# Altium schematic sheet ETH-PHY.SchDoc
size A4; CompanyName: Technische Hochschule Nürnberg Georg Simon Ohm; Organization: UltraZohm; Address1: Kesslerplatz 12; Address2: 90489 Nürnberg; Address3: GERMANY; SheetNumber: 30; Website: www.ultrazohm.com
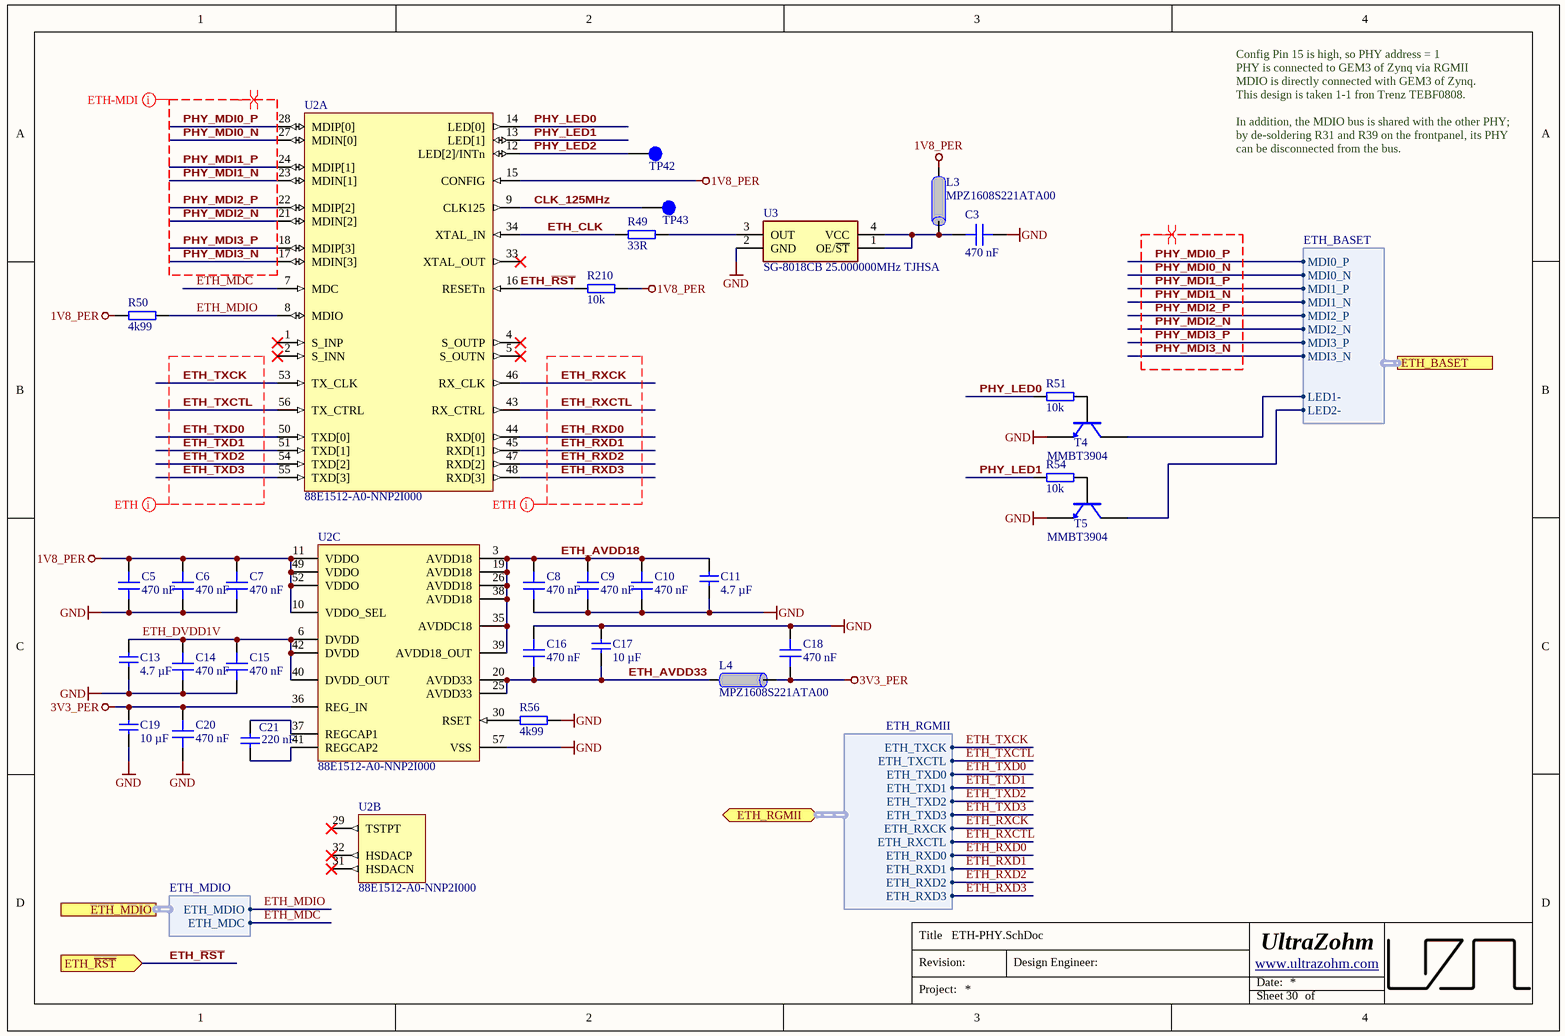
[diagram p0: ETH-PHY.SchDoc]

## Parts
C3  470 nF  [C_0603_TE]
C5  470 nF  [C_0603_TE]
C6  470 nF  [C_0603_TE]
C7  470 nF  [C_0603_TE]
C8  470 nF  [C_0603_TE]
C9  470 nF  [C_0603_TE]
C10  470 nF  [C_0603_TE]
C11  4.7 µF  [C_0603_TE]
C13  4.7 µF  [C_0603_TE]
C14  470 nF  [C_0603_TE]
C15  470 nF  [C_0603_TE]
C16  470 nF  [C_0603_TE]
C17  10 µF  [C_0603_TE]
C18  470 nF  [C_0603_TE]
C19  10 µF  [C_0603_TE]
C20  470 nF  [C_0603_TE]
C21  220 nF  [C_0603_TE]
L3  MPZ1608S221ATA00  [RES 0603_1608]
L4  MPZ1608S221ATA00  [RES 0603_1608]
R49  33R  [R_0603_TE]
R50  4k99  [RES 0603_1608]
R51  10k  [R_0603_TE]
R54  10k  [R_0603_TE]
R56  4k99  [RES 0603_1608]
R210  10k  [R_0603_TE]
T4  MMBT3904  [SOT95P280X145-3N]
T5  MMBT3904  [SOT95P280X145-3N]
TP42  Testpoint 1mm  [TP_1mm]  (value not drawn)  (no BOM)
TP43  Testpoint 1mm  [TP_1mm]  (value not drawn)  (no BOM)
U2  88E1512-A0-NNP2I000  [QFN50P800X800X100-57N]  (parts A,B,C of 3)
U3  SG-8018CB 25.000000MHz TJHSA  [SMD5032-4P]

## Ports
ETH_BASET (harness ETH_BASET), ETH_MDIO (harness ETH_MDIO), ETH_RGMII (bidir, harness ETH_RGMII), ETH_~{RST} (in)

## Harnesses
ETH_RGMII: ETH_TXCK, ETH_TXCTL, ETH_TXD0, ETH_TXD1, ETH_TXD2, ETH_TXD3, ETH_RXCK, ETH_RXCTL, ETH_RXD0, ETH_RXD1, ETH_RXD2, ETH_RXD3
ETH_MDIO: ETH_MDC, ETH_MDIO
ETH_BASET: MDI0_P, MDI0_N, MDI1_P, MDI1_N, MDI2_P, MDI2_N, MDI3_P, MDI3_N, LED1-, LED2-

## Nets
1V8_PER: C5.1 C6.1 C7.1 L3.1 R50.1 R210.2 U2.10(VDDO_SEL) U2.11(VDDO) U2.15(CONFIG) U2.49(VDDO) U2.52(VDDO)
3V3_PER: C18.2 C19.1 C20.1 L4.2 U2.36(REG_IN)
GND: C3.1 C5.2 C6.2 C7.2 C8.2 C9.2 C10.2 C11.2 C13.2 C14.2 C15.2 C16.1 C17.1 C18.1 C19.2 C20.2 R56.2 T4.2(EMITTER) T5.2(EMITTER) U2.57(VSS) U3.2(GND)
CLK_125MHz: TP43.1 U2.9(CLK125)
ETH_AVDD18: C8.1 C9.1 C10.1 C11.1 U2.3(AVDD18) U2.19(AVDD18) U2.26(AVDD18) U2.35(AVDDC18) U2.38(AVDD18) U2.39(AVDD18_OUT)
ETH_AVDD33: C16.2 C17.2 L4.1 U2.20(AVDD33) U2.25(AVDD33)
ETH_CLK: R49.1 U2.34(XTAL_IN)
ETH_DVDD1V: C13.1 C14.1 C15.1 U2.6(DVDD) U2.40(DVDD_OUT) U2.42(DVDD)
ETH_MDC: U2.7(MDC) ; port ETH_MDIO.ETH_MDC
ETH_MDIO: R50.2 U2.8(MDIO) ; port ETH_MDIO.ETH_MDIO
ETH_~{RST}: R210.1 U2.16(RESETn) ; port ETH_~{RST}
ETH_RXCK: U2.46(RX_CLK) ; port ETH_RGMII.ETH_RXCK
ETH_RXCTL: U2.43(RX_CTRL) ; port ETH_RGMII.ETH_RXCTL
ETH_RXD0: U2.44(RXD[0]) ; port ETH_RGMII.ETH_RXD0
ETH_RXD1: U2.45(RXD[1]) ; port ETH_RGMII.ETH_RXD1
ETH_RXD2: U2.47(RXD[2]) ; port ETH_RGMII.ETH_RXD2
ETH_RXD3: U2.48(RXD[3]) ; port ETH_RGMII.ETH_RXD3
ETH_TXCK: U2.53(TX_CLK) ; port ETH_RGMII.ETH_TXCK
ETH_TXCTL: U2.56(TX_CTRL) ; port ETH_RGMII.ETH_TXCTL
ETH_TXD0: U2.50(TXD[0]) ; port ETH_RGMII.ETH_TXD0
ETH_TXD1: U2.51(TXD[1]) ; port ETH_RGMII.ETH_TXD1
ETH_TXD2: U2.54(TXD[2]) ; port ETH_RGMII.ETH_TXD2
ETH_TXD3: U2.55(TXD[3]) ; port ETH_RGMII.ETH_TXD3
PHY_LED0: R51.1 U2.14(LED[0])
PHY_LED1: R54.1 U2.13(LED[1])
PHY_LED2: TP42.1 U2.12(LED[2]/INTn)
PHY_MDI0_N: U2.27(MDIN[0]) ; port ETH_BASET.MDI0_N
PHY_MDI0_P: U2.28(MDIP[0]) ; port ETH_BASET.MDI0_P
PHY_MDI1_N: U2.23(MDIN[1]) ; port ETH_BASET.MDI1_N
PHY_MDI1_P: U2.24(MDIP[1]) ; port ETH_BASET.MDI1_P
PHY_MDI2_N: U2.21(MDIN[2]) ; port ETH_BASET.MDI2_N
PHY_MDI2_P: U2.22(MDIP[2]) ; port ETH_BASET.MDI2_P
PHY_MDI3_N: U2.17(MDIN[3]) ; port ETH_BASET.MDI3_N
PHY_MDI3_P: U2.18(MDIP[3]) ; port ETH_BASET.MDI3_P
NetC3_2: C3.2 L3.2 U3.1(OE/~{ST}) U3.4(VCC)
NetC21_1: C21.1 U2.37(REGCAP1)
NetC21_2: C21.2 U2.41(REGCAP2)
NetR49_2: R49.2 U3.3(OUT)
NetR51_2: R51.2 T4.1(BASIS)
NetR54_2: R54.2 T5.1(BASIS)
NetR56_1: R56.1 U2.30(RSET)
NetT4_3: T4.3(COLLECTOR) ; port ETH_BASET.LED1-
NetT5_3: T5.3(COLLECTOR) ; port ETH_BASET.LED2-

Not connected (* = marked no-connect by the designer): U2 1(S_INP)* 2(S_INN)* 4(S_OUTP)* 5(S_OUTN)* 29(TSTPT)* 31(HSDACN)* 32(HSDACP)* 33(XTAL_OUT)*

## Layout directives
net class ETH: ETH_RXCK, ETH_RXCTL, ETH_RXD0, ETH_RXD1, ETH_RXD2, ETH_RXD3, ETH_TXCK, ETH_TXCTL, ETH_TXD0, ETH_TXD1, ETH_TXD2, ETH_TXD3
differential pair: PHY_MDI0_N, PHY_MDI0_P, PHY_MDI1_N, PHY_MDI1_P, PHY_MDI2_N, PHY_MDI2_P, PHY_MDI3_N, PHY_MDI3_P
net class ETH-MDI: PHY_MDI0_N, PHY_MDI0_P, PHY_MDI1_N, PHY_MDI1_P, PHY_MDI2_N, PHY_MDI2_P, PHY_MDI3_N, PHY_MDI3_P

## Notes on the sheet
- Config Pin 15 is high, so PHY address = 1
  PHY is connected to GEM3 of Zynq via RGMII
  MDIO is directly connected with GEM3 of Zynq.
  This design is taken 1-1 fron Trenz TEBF0808.
  In addition, the MDIO bus is shared with the other PHY; by de-soldering R31 and R39 on the frontpanel, its PHY can be disconnected from the bus.
- Title
- Revision:
- Design Engineer:
- Date:
- Project:
- Sheet
- of

## Library data of the parts
C3 C5-C10 C14-C16 C18 C20 = CL10A474KB8NNNC: Capacitor 0603, 50 VDC, 470 nF, X5R; Manufacturer: Samsung Electro-Mechanics; Tolerance: 10 %; Voltage Rating: 50 VDC; Created from: AGeiger; Value: 470 nF; Manufacturer Part Number: CL10A474KB8NNNC; PartID: 103; Created On: 22/08/2022 14:44:45; ComponentLink1Description: Datasheet; ComponentLink1URL: https://datasheet.lcsc.com/lcsc/1810191213_Samsung-Electro-Mechanics-CL10A474KB8NNNC_C170149.pdf; Component Type: Capacitor 0603; Device Package: 0603; Last Updated: 22/04/2025 15:48:45; Mounting Type: SMD; Operating Temperature: -55 - 85°C; Series: X5R; Supplier 1: LCSC; Supplier Part Number 1: C170149; Supplier 2: Mouser; Supplier Part Number 2: 187-CL10A474KB8NNNC; Type: Capacitor; Live Cycle Status: 1; LCSC Part Number: C170149
C11 C13 = UZgen_C_0603_4.7uF_16V_X5R: Generic capacitor; Manufacturer: UZgen; Tolerance: 10 %; Created from: MGeier; Voltage: 16V; Value: 4.7 µF; Manufacturer Part Number: UZgen_C_0603_4.7uF_16V_X5R; PartID: 5809; Created On: 20/03/2025 14:43:45; Device Package: 0603; Last Updated: 20/03/2025 14:43:45; Mounting Type: SMD; Technology: X5R
C17 C19 = UZgen_C_0603_10uF_6.3V_X7R: Generic capacitor; Manufacturer: UZgen; Tolerance: 10 %; Created from: UZgenTool; Voltage: 6.3V; Value: 10 µF; Manufacturer Part Number: UZgen_C_0603_10uF_6.3V_X7R; PartID: 3631; Created On: 02/08/2024 11:17:55; Device Package: 0603; Last Updated: 02/08/2024 11:17:55; Mounting Type: SMD; Technology: X7R
C21 = UZgen_C_0603_220nF_50V_X7R: Generic capacitor; Manufacturer: UZgen; Tolerance: 10 %; Voltage: 50V; Created from: UZgenTool; Value: 220 nF; Technology: X7R; Manufacturer Part Number: UZgen_C_0603_220nF_50V_X7R; PartID: 2; Created On: 02/07/2024 14:42:23; Device Package: 0603; Mounting Type: SMD; Last Updated: 08/08/2024 15:01:15
L3 L4 = MPZ1608S221ATA00: Ferritperle, 0603, 220 ohm, 2.2 A, Baureihe MPZ, 0.05 ohm, ± 25%; Manufacturer: TDK; Value: 220 Ohm; Type: Ferrite; DC current: 2.2 A; Created from: MGremer; Manufacturer Part Number: MPZ1608S221ATA00; PartID: 3; Created On: 08/06/2021 11:33:39; ComponentLink1Description: Datasheet; ComponentLink1URL: http://www.farnell.com/datasheets/2291439.pdf; Component Type: Ferritperle; Device Package: 0603; Last Updated: 12/07/2024 17:26:54; Mounting Type: SMD; Operating Temperature: -55 - 125 °C; Series: MPZ; Supplier 1: Farnell; Supplier Part Number 1: 1301677RL; Live Cycle Status: 1; LCSC Part Number: C76815; Stock number: not stored
R49 = UZgen_R_0603_33R: Generic resistor; Manufacturer: UZgen; Tolerance: 1 %; Created from: UZgenTool; Value: 33R; Manufacturer Part Number: UZgen_R_0603_33R; PartID: 185; Created On: 02/07/2024 17:29:48; Device Package: 0603; Mounting Type: SMD; Last Updated: 02/07/2024 17:29:48
R50 R56 = 0603WAF4991T5E: 1/10W Thick Film Resistors 75V ±1% ±100ppm/℃ -55℃~+155℃ 4.99kΩ 0603 Chip Resistor - Surface Mount ROHS; Manufacturer: UNI-ROYAL(Uniroyal Elec); Created from: NDiringer; Tolerance: 1%; Value: 4k99; Manufacturer Part Number: 0603WAF4991T5E; PartID: 230; Created On: 17/08/2022 08:08:34; ComponentLink1Description: Datasheet; ComponentLink1URL: https://datasheet.lcsc.com/lcsc/2206010116_UNI-ROYAL-Uniroyal-Elec-0603WAF4991T5E_C23046.pdf; Component Type: SMD resistor; Device Package: 0603; Last Updated: 17/08/2022 08:08:34; Mounting Type: SMD; Supplier 1: LCSC/JLCPCB; Supplier Part Number 1: C23046; Supplier 2: Mouser; Supplier Part Number 2: 303-0603WAF4991T5E; Type: Resistor; Live Cycle Status: 1; Stock number: not stored; LCSC Part Number: C23046
R51 R54 R210 = UZgen_R_0603_10k: Generic resistor; Manufacturer: UZgen; Tolerance: 1 %; Created from: AGeiger; Value: 10k; Manufacturer Part Number: UZgen_R_0603_10k; PartID: 1; Created On: 02/07/2024 14:34:53; Device Package: 0603; Mounting Type: SMD; Last Updated: 02/07/2024 14:37:16
T4 T5 = MMBT3904: Bipolartransistor, 40V 200mW 200mA 100@10mA,1V 300MHz 300mV@50mA,5mA NPN +150℃@(Tj) SOT-23(SOT-23-3); Manufacturer: Jiangsu Changjing Electronics Technology Co., Ltd.; Number Of Channels: single; Collector Basis Voltage: 60 V; Created from: NDiringer; Manufacturer Part Number: MMBT3904; PartID: 2; Created On: 10/06/2022 12:04:49; ComponentLink1Description: Datasheet; ComponentLink1URL: https://datasheet.lcsc.com/lcsc/1811011934_Jiangsu-Changjing-Electronics-Technology-Co---Ltd--MMBT3904_C20526.pdf; Component Type: Bipolartransistor; Device Package: SOT-23-3; Last Updated: 10/08/2022 13:48:16; Mounting Type: SMD; Operating Temperature: -55 - 150 °C; Series: MMBT3904; Supplier 1: Mouser; Supplier Part Number 1: MMBT3904; Supplier 2: LCSC/JLCPCB; Supplier Part Number 2: C20526; Type: Bipolartransistor; Collector Emitter Voltage: 40 V; Polarization: NPN; Power Dissipation: 200 mW; Value: 40 V; Live Cycle Status: 1; LCSC Part Number: C20526
TP42 TP43 = NULL: Manufacturer Part Number: NULL; Created from: AGeiger; Created: 2018_06_25_AGeiger; Value: Testpoint 1mm; PartID: 9; Created On: 20/09/2022 13:14:57; Component Type: Testpoint; Last Updated: 20/09/2022 13:15:39; Manufacturer: NULL; Supplier 1: NULL; Supplier Part Number 1: NULL; Type: Testpoint; Live Cycle Status: 1
U2 = 88E1512-A0-NNP2I000: Ethernet ICs Single-Port EEE GE PHY w/SGMII in 56-pin QFN; Manufacturer: Marvell; Created from: MGremer; Manufacturer Part Number: 88E1512-A0-NNP2I000; PartID: 1; Created On: 01/12/2020 16:21:41; ComponentLink1Description: Datasheet; ComponentLink1URL: https://www.mouser.de/datasheet/2/912/marvell-phys-transceivers-alaska-88e151x-datasheet-1360912.pdf; Component Type: Ethernet Single-Port; Device Package: QFN65; Last Updated: 26/06/2024 13:40:11; Mounting Type: SMD; Supplier 1: Mouser; Supplier Part Number 1: 348-88E1512A0NNP2I00; Type: Ethernet Single-Port; Live Cycle Status: 1; LCSC Part Number: C713256; Stock number: not stored
U3 = SG-8018CB 25.000000MHz TJHSA: ±50ppm 1.8V~3.3V 25MHz SMD5032-4P Programmable Oscillators ROHS; Manufacturer: Seiko Epson; Created from: FRosner; Value: 25 MHz; Manufacturer Part Number: SG-8018CB 25.000000MHz TJHSA; PartID: 3; Created On: 15/08/2024 10:38:39; ComponentLink1Description: Datasheet; ComponentLink1URL: https://download.epsondevice.com/td/pdf/app/SG-8018CB_en.pdf; Component Type: Oscillator; Device Package: 5032; Last Updated: 15/08/2024 10:38:39; Mounting Type: SMD; Operating Temperature: -40 to +105°C; Supplier 1: LCSC; Supplier Part Number 1: C390471; LCSC Part Number: C390471